# EAGLE schematic diff-neg-VCO-100kzh-12Mhz-alc (EAGLE 5.10)
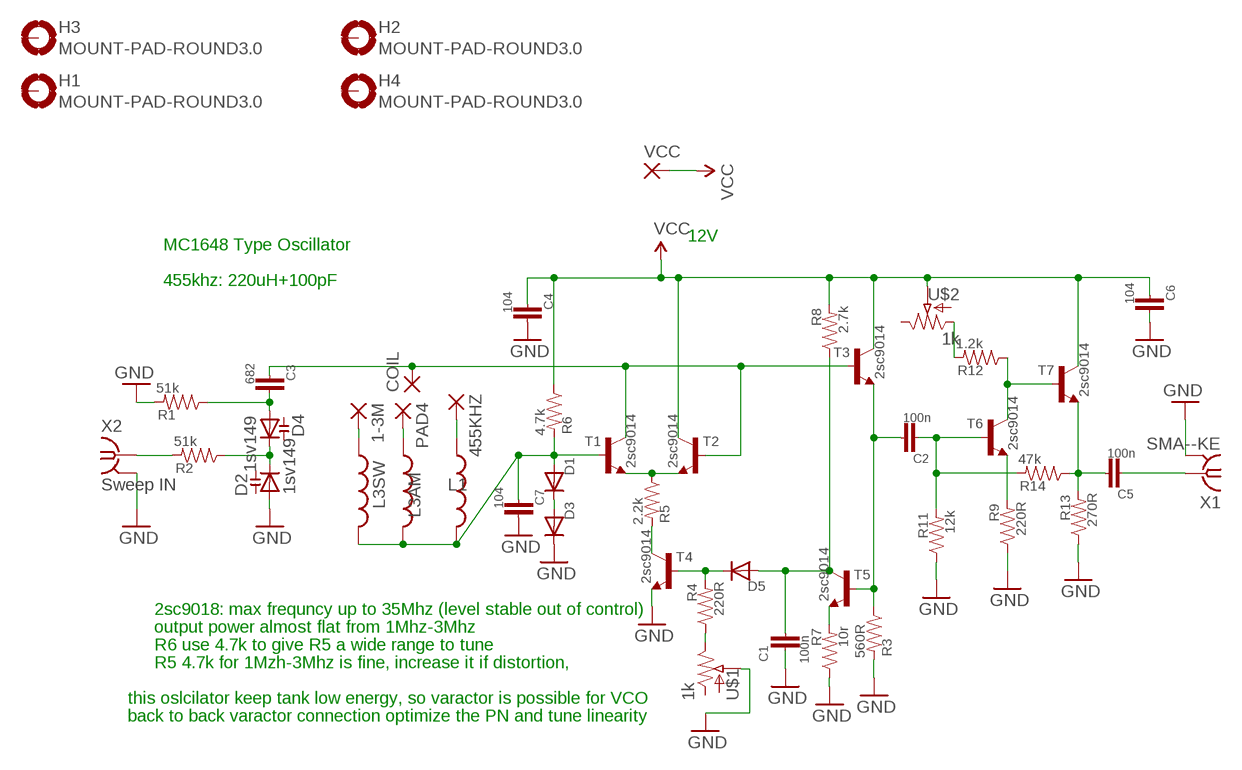
[diagram p0: schematic, sheet 1]

## Parts
1-3M  WIREPAD2,54/1,1  [2,54/1,1]
455KHZ  WIREPAD2,54/1,0  [2,54/1,0]
C1  100n  CAPPTH1  [CAP-PTH-5MM]
C2  100n  CAPPTH1  [CAP-PTH-5MM]
C3  682  CAPPTH1  [CAP-PTH-5MM]
C4  104  CAPPTH1  [CAP-PTH-5MM]
C5  100n  CAPPTH1  [CAP-PTH-5MM]
C6  104  CAPPTH1  [CAP-PTH-5MM]
C7  104  CAPPTH1  [CAP-PTH-5MM]
COIL  WIREPAD3,81/1,1  [3,81/1,1]
D1  DIODE1N4148  [DIODE-1N4148]
D2  1sv149  BB112  [SOT54H]
D3  DIODE1N4148  [DIODE-1N4148]
D4  1sv149  BB112  [SOT54H]
D5  DIODE1N4148  [DIODE-1N4148]
H1  MOUNT-PAD-ROUND3.0  [3,0-PAD]
H2  MOUNT-PAD-ROUND3.0  [3,0-PAD]
H3  MOUNT-PAD-ROUND3.0  [3,0-PAD]
H4  MOUNT-PAD-ROUND3.0  [3,0-PAD]
L1  COILL5  [L-5]
L3  AM-SM-COIL  [AM-SM-COIL]
PAD4  WIREPAD2,54/0,9  [2,54/0,9]
R1  51k  RESISTOR0207/7(1/4W)  [0207/7]
R2  51k  RESISTOR0207/7(1/4W)  [0207/7]
R3  560R  RESISTOR0207/7(1/4W)  [0207/7]
R4  220R  RESISTOR0207/7(1/4W)  [0207/7]
R5  2.2k  RESISTOR0207/7(1/4W)  [0207/7]
R6  4.7k  RESISTOR0207/7(1/4W)  [0207/7]
R7  10r  RESISTOR0207/7(1/4W)  [0207/7]
R8  2.7k  RESISTOR0207/7(1/4W)  [0207/7]
R9  220R  RESISTOR0207/7(1/4W)  [0207/7]
R11  12k  RESISTOR0207/7(1/4W)  [0207/7]
R12  1.2k  RESISTOR0207/7(1/4W)  [0207/7]
R13  270R  RESISTOR0207/7(1/4W)  [0207/7]
R14  47k  RESISTOR0207/7(1/4W)  [0207/7]
T1  2sc9014  -NPN-TO92-EBC  [TO92-EBC]
T2  2sc9014  -NPN-TO92-EBC  [TO92-EBC]
T3  2sc9014  -NPN-TO92-EBC  [TO92-EBC]
T4  2sc9014  -NPN-TO92-EBC  [TO92-EBC]
T5  2sc9014  -NPN-TO92-EBC  [TO92-EBC]
T6  2sc9014  -NPN-TO92-EBC  [TO92-EBC]
T7  2sc9014  -NPN-TO92-EBC  [TO92-EBC]
U$1  1k  POTB25P-3362P  [B25P]
U$2  1k  POTB25P-3362P  [B25P]
VCC  WIREPAD2,54/1,0  [2,54/1,0]
X1  SMA--KE  [SMA-KE]
X2  Sweep IN  SMA--KE  [SMA-KE]

## Nets
GND: C1.2 C4.1 C6.1 C7.1 D2.A D3.C R1.2 R3.2 R7.1 R9.1 R11.1 R13.1 T4.E U$1.S X1.G@1(GND) X2.G@1(GND)
N$1: C3.1 D4.A R1.1
N$2: R9.2 T6.E
N$3: R5.1 T1.E T2.E
N$4: D1.C D3.A
N$5: D2.C D4.C R2.1
N$6: C2.2 R11.2 R14.2 T6.B
N$7: C3.2 COIL.1(P) T1.C T2.B T3.B
N$8: R2.2 X2.1
N$9: R5.2 T4.C
N$10: C2.1 R3.1 T3.E T5.B
N$11: D5.C R4.2 T4.B
N$12: R4.1 U$1.E
N$13: R7.2 T5.E
N$14: C1.1 D5.A R8.1 T5.C
N$15: C5.2 X1.1
N$16: R12.1 T6.C T7.B
N$17: R12.2 U$2.A
N$18: C5.1 R13.2 R14.1 T7.E
N$19: C7.2 D1.A L1.2 L3.AM2 L3.SW2 R6.2 T1.B
N$21: 1-3M.1(P) L3.SW1
N$22: L3.AM1 PAD4.1(P)
N$23: 455KHZ.1(P) L1.1
VCC: C4.2 C6.2 R6.1 R8.2 T2.C T3.C T7.C U$2.S VCC.1(P)
Unconnected: H1.B3,0(MOUNT) H2.B3,0(MOUNT) H3.B3,0(MOUNT) H4.B3,0(MOUNT) U$1.A U$2.E

## Notes on the sheet
- 12V
- MC1648 Type Oscillator
- 455khz: 220uH+100pF
- 2sc9018: max frequncy up to 35Mhz (level stable out of control)
- output power almost flat from 1Mhz-3Mhz
- R6 use 4.7k to give R5 a wide range to tune
- R5 4.7k for 1Mzh-3Mhz is fine, increase it if distortion,
- this oslcilator keep tank low energy, so varactor is possible for VCO
- back to back varactor connection optimize the PN and tune linearity

## Power pins joined to a net without a drawn wire
GND: X1.G@2(GND) X1.G@3(GND) X1.G@4(GND) X2.G@2(GND) X2.G@3(GND) X2.G@4(GND)

## Library data of the parts
1-3M 455KHZ COIL PAD4 VCC = wirepad:WIREPAD: Wire PAD connect wire on PCB
C1-C7 = digital-toy:CAP: Capacitor Standard 0603 ceramic capacitor, and 0.1" leaded capacitor.
D1 D3 D5 = digital-toy:DIODE: Diode These are standard reverse protection diodes and small signal diodes. SMA package can handle up to about 1A. SOD-323 can handle about 200mA. What the SOD-323 package when ordering, there are some mfgs out there that are 5-pin packages.
D2 D4 = dtoy-RF:BB112: Capacity DIODE variable-capacitance diode
H1-H4 = holes:MOUNT-PAD-ROUND: MOUNTING PAD, round
L1 = dtoy-RF:COIL
L3 = dtoy-RF:AM-SM-COIL
R1-R9 R11-R14 = digital-toy:RESISTOR: Resistor Basic schematic elements and footprints for 0603, 1206, and PTH 1/10th watt (small) resistors. digital-toy copy vertical mount of axial-0.3 from rcl.lbr : the 0207/xx 3W resistor: 0617/17, 0617/22, 0617V
T1-T7 = digital-toy:*-NPN-: NPN Transistror most of sot-23 use the pacages sot23-BEC, top C, left B, right E. by hyl, digital-toy. and to-92 use ebc(from-top) by hyl, digital-toy.
U$1 U$2 = digital-toy:POT: POT digital toy POT, 3296 multi turn, blue-white ... hyl 8/07/2001
X1 X2 = dtoy-RF:SMA-: SMA 50 Ohm End Launch Jack Receptacle - Round Contact Johnson Components Source: www.johnsoncomponents.com .. J502-ND.pdf